# EAGLE schematic untitled (EAGLE 7.5.0)
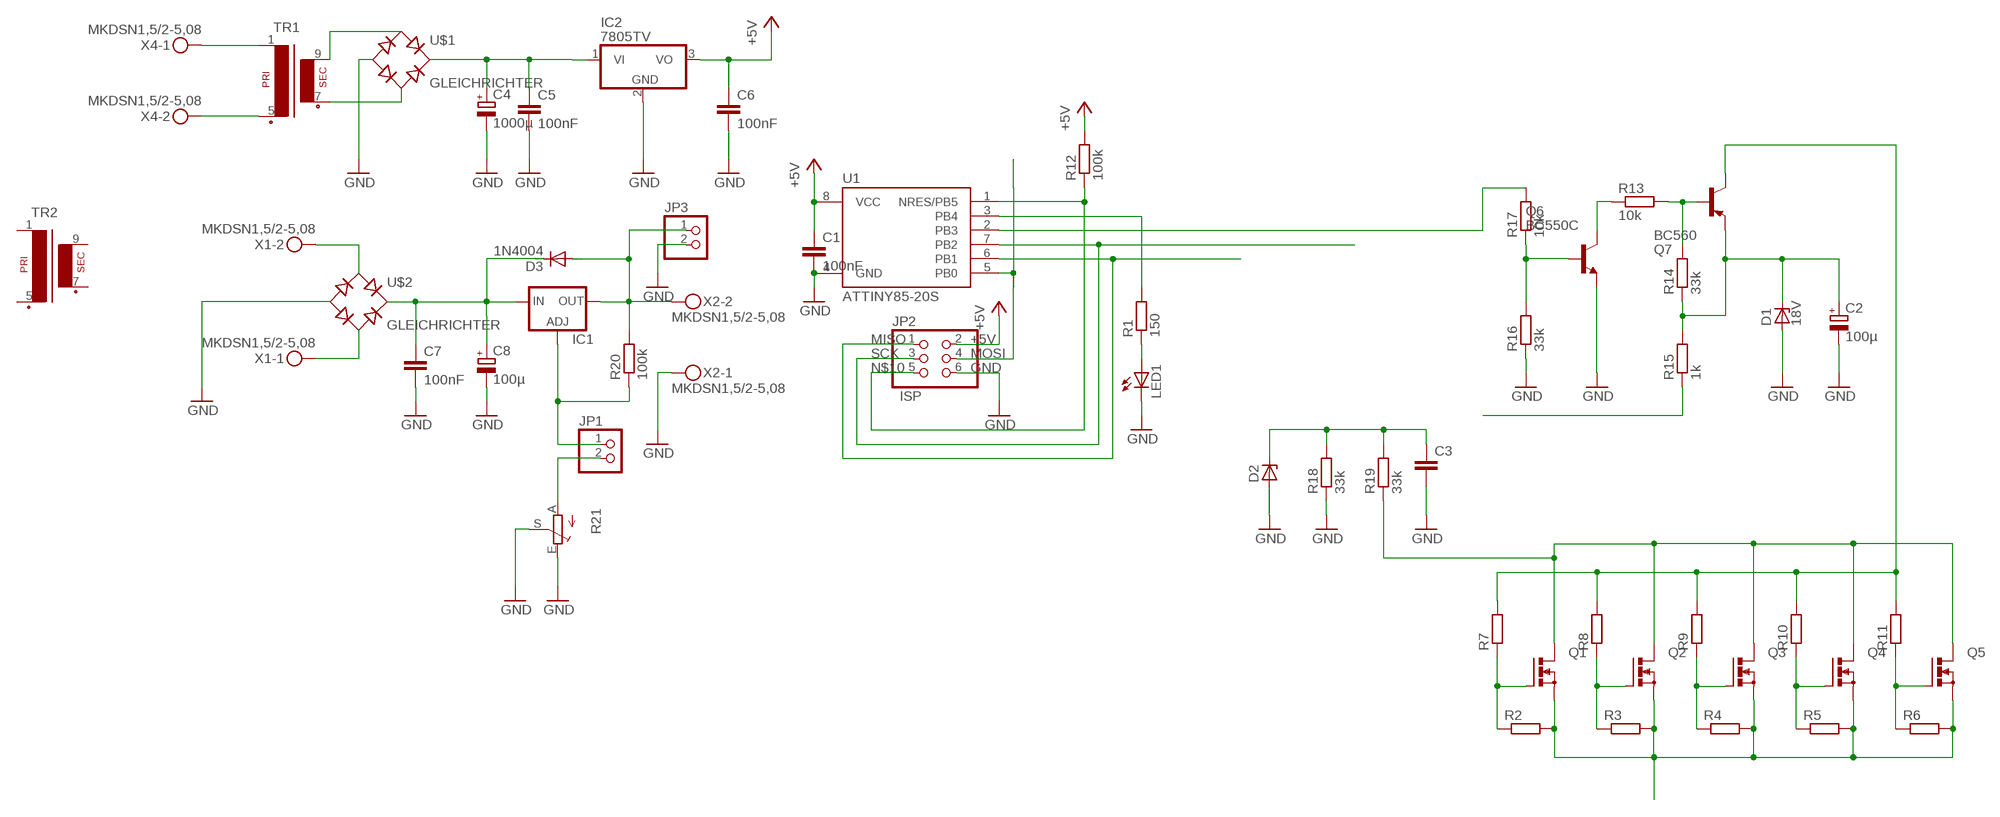
[diagram p0: schematic, sheet 1]

## Parts
C1  100nF  C-EUC0805  [C0805]
C2  100µ  CPOL-EUE2.5-7  [E2,5-7]
C3  C-EUC0603K  [C0603K]
C4  1000µ  CPOL-EUE3.5-8  [E3,5-8]
C5  100nF  C-EUC0805  [C0805]
C6  100nF  C-EUC0805  [C0805]
C7  100nF  C-EUC0805  [C0805]
C8  100µ  CPOL-EUE3.5-8  [E3,5-8]
D1  18V  ZENER-DIODESOD80C  [SOD80C]
D2  ZENER-DIODESOT23  [SOT23]
D3  1N4004  [DO41-10]
IC1  LM317TS  [317TS]
IC2  7805TV  [TO220V]
JP1  PINHD-1X2  [1X02]
JP2  PINHD-2X3  [2X03]
JP3  PINHD-1X2  [1X02]
LED1  LED3MM  [LED3MM]
Q1  PMOSFET_NTO220BV  [TO220BV]
Q2  PMOSFET_NTO220BV  [TO220BV]
Q3  PMOSFET_NTO220BV  [TO220BV]
Q4  PMOSFET_NTO220BV  [TO220BV]
Q5  PMOSFET_NTO220BV  [TO220BV]
Q6  BC550C  [TO92-EBC]
Q7  BC560  [TO92-EBC]
R1  150  R-EU_R1206  [R1206]
R2  R-EU_0207/10  [0207/10]
R3  R-EU_0207/10  [0207/10]
R4  R-EU_0207/10  [0207/10]
R5  R-EU_0207/10  [0207/10]
R6  R-EU_0207/10  [0207/10]
R7  R-EU_0207/10  [0207/10]
R8  R-EU_0207/10  [0207/10]
R9  R-EU_0207/10  [0207/10]
R10  R-EU_0207/10  [0207/10]
R11  R-EU_0207/10  [0207/10]
R12  100k  R-EU_R1206  [R1206]
R13  10k  R-EU_R1206  [R1206]
R14  33k  R-EU_R1206  [R1206]
R15  1k  R-EU_R1206  [R1206]
R16  33k  R-EU_R1206  [R1206]
R17  10k  R-EU_R1206  [R1206]
R18  33k  R-EU_R1206  [R1206]
R19  33k  R-EU_R1206  [R1206]
R20  100k  R-EU_R1206  [R1206]
R21  TRIM_EU-PT10  [PT-10]
TR1  EI38-1  [EI38-1]
TR2  EI38-1  [EI38-1]
U1  ATTINY85-20S  [SOIC8_EIAJ_208MIL]
U$1  GLEICHRICHTER  [KBPC1]
U$2  GLEICHRICHTER  [KBPC1]
X1  MKDSN1,5/2-5,08  [MKDSN1,5/2-5,08]
X2  MKDSN1,5/2-5,08  [MKDSN1,5/2-5,08]
X4  MKDSN1,5/2-5,08  [MKDSN1,5/2-5,08]

## Nets
+5V: C1.1 C6.1 IC2.3(VO) JP2.2 R12.2 U1.8(VCC)
GND: C1.2 C2.- C3.2 C4.- C5.2 C6.2 C7.2 C8.- D1.A D2.1(A) IC2.2(GND) JP2.6 JP3.2 LED1.K(C) Q6.E R16.1 R18.1 R21.E R21.S U1.4(GND) U$1.- U$2.- X2.1
MISO: JP2.1 U1.6(PB1)
MOSI: JP2.4 U1.5(PB0)
N$1: Q7.B R13.2 R14.2
N$2: Q5.G R6.1 R11.1
N$3: Q6.B R16.2 R17.1
N$4: Q4.G R5.1 R10.1
N$5: Q6.C R13.1
N$6: LED1.A R1.1
N$7: Q3.G R4.1 R9.1
N$8: C2.+ D1.C Q7.E R14.1 R15.2
N$9: Q2.G R3.1 R8.1
N$10: JP2.5 R12.1 U1.1(NRES/PB5)
N$11: Q1.S Q2.S Q3.S Q4.S Q5.S R2.2 R3.2 R4.2 R5.2 R6.2
N$12: R1.2 U1.3(PB4)
N$13: Q1.G R2.1 R7.1
N$14: C3.1 D2.3(C) R18.2 R19.2
N$15: R15.1
N$16: Q1.D Q2.D Q3.D Q4.D Q5.D R19.1
N$17: C4.+ C5.1 IC2.1(VI) U$1.+
N$18: Q7.C R7.2 R8.2 R9.2 R10.2 R11.2
N$19: TR1.1 X4.1
N$20: TR1.5(P2) X4.2
N$21: TR1.7(S3) U$1.AC2
N$22: TR1.9(S4) U$1.AC1
N$23: R17.2 U1.2(PB3)
N$24: U$2.AC1 X1.2
N$25: U$2.AC2 X1.1
N$27: C7.1 C8.+ D3.C IC1.3(IN) U$2.+
N$28: D3.A IC1.2(OUT) JP3.1 R20.2 X2.2
N$29: JP1.2 R21.A
N$30: IC1.1(ADJ) JP1.1 R20.1
SCK: JP2.3 U1.7(PB2)
Unconnected: TR2.1 TR2.5(P2) TR2.7(S3) TR2.9(S4)

## Notes on the sheet
- ISP

## Library data of the parts
C1 C3 C5-C7 = rcl:C-EU: CAPACITOR, European symbol
C2 = resistor:CPOL-EU: POLARIZED CAPACITOR, European symbol
C4 C8 = rcl:CPOL-EU: POLARIZED CAPACITOR, European symbol
D1 D2 = diode:ZENER-DIODE: Z-Diode
D3 = diode:1N4004: DIODE general purpose rectifier, 1 A
IC1 = v-reg:LM317TS: VOLTAGE REGULATOR
IC2 = linear:78*: Positive VOLTAGE REGULATOR Source: http://cache.national.com/ds/LM/LM78L05.pdf http://www.fairchildsemi.com/ds/LM/LM7805.pdf
JP1 JP3 = pinhead:PINHD-1X2: PIN HEADER
JP2 = pinhead:PINHD-2X3: PIN HEADER
LED1 = led:LED: LED OSRAM: - CHIPLED LG R971, LG N971, LY N971, LG Q971, LY Q971, LO R971, LY R971 LH N974, LH R974 LS Q976, LO Q976, LY Q976 LO Q996 - Hyper CHIPLED LW Q18S LB Q993, LB Q99A, LB R99A - SideLED LS A670, LO A670, LY A670, LG A670, LP A670 LB A673, LV A673, LT A673, LW A673 LH A674 LY A675 LS A676, LA A676, LO A676, LY A676, LW A676 LS A679, LY A679, LG A679 - Hyper Micro SIDELED® LS Y876, LA Y876, LO Y876, LY Y876 LT Y87S - SmartLED LW L88C, LW L88S LB L89C, LB L89S, LG L890 LS L89K, LO L89K, LY L89K LS L896, LA L896, LO L896, LY L896 - TOPLED LS T670, LO T670, LY T670, LG T670, LP T670 LSG T670, LSP T670, LSY T670, LOP T670, LYG T670 LG T671, LOG T671, LSG T671 LB T673, LV T673, LT T673, LW T673 LH T674 LS T676, LA T676, LO T676, LY T676, LB T676, LH T676, LSB T676, LW T676 LB T67C, LV T67C, LT T67C, LS T67K, LO T67K, LY T67K, LW E67C LS E67B, LA E67B, LO E67B, LY E67B, LB E67C, LV E67C, LT E67C LW T67C LS T679, LY T679, LG T679 LS T770, LO T770, LY T770, LG T770, LP T770 LB T773, LV T773, LT T773, LW T773 LH T774 LS E675, LA E675, LY E675, LS T675 LS T776, LA T776, LO T776, LY T776, LB T776 LHGB T686 LT T68C, LB T68C - Hyper Mini TOPLED® LB M676 - Mini TOPLED Santana® LG M470 LS M47K, LO M47K, LY M47K Source: http://www.osram.convergy.de LUXEON: - LUMILED® LXK2-PW12-R00, LXK2-PW12-S00, LXK2-PW14-U00, LXK2-PW14-V00 LXK2-PM12-R00, LXK2-PM12-S00, LXK2-PM14-U00 LXK2-PE12-Q00, LXK2-PE12-R00, LXK2-PE12-S00, LXK2-PE14-T00, LXK2-PE14-U00 LXK2-PB12-K00, LXK2-PB12-L00, LXK2-PB12-M00, LXK2-PB14-N00, LXK2-PB14-P00, LXK2-PB14-Q00 LXK2-PR12-L00, LXK2-PR12-M00, LXK2-PR14-Q00, LXK2-PR14-R00 LXK2-PD12-Q00, LXK2-PD12-R00, LXK2-PD12-S00 LXK2-PH12-R00, LXK2-PH12-S00 LXK2-PL12-P00, LXK2-PL12-Q00, LXK2-PL12-R00 Source: www.luxeon.com KINGBRIGHT: KA-3528ASYC Source: www.kingbright.com
Q1-Q5 = transistor-power:PMOSFET_N: Power MOSFET N-Channel
Q6 = transistor-npn:BC550*: NPN Transistor
Q7 = transistor-pnp:BC560*: PNP Transistror
R1 R12 R20 = rcl:R-EU_: RESISTOR, European symbol
R2-R11 R13-R19 = resistor:R-EU_: RESISTOR, European symbol
R21 = pot:TRIM_EU-: POTENTIOMETER
TR1 TR2 = trafo:EI38-1: TRANSFORMER 1 primary winding, 1 secondary winding ERA
U1 = _hhn_attiny25_45_85:ATTINY85*: ATMEL ATtiny 85 Packages: P = PDIP 08 30mil S = SOIC 08 EIAJ 208mil Technologies Note: for complete ordering code (temp. range, finish, tape&reel etc.) see www.atmel.com • Supply Voltage: V = (1.8…5.5)V | [blank] = (2.7…5.5)V • Speed: 10 = 10 MHz | 20 = 20 MHz Author: Dipl.-Ing. FH Rainer Bayer HHN Hochschule Heilbronn (Heilbronn University), rainer.bayer@hs-heilbronn.de Ingenieurbüro ing-rb, mail@ing-rb.de
U$1 U$2 = Gleichrichter:GLEICHRICHTER
X1 X2 X4 = con-phoenix-508:MKDSN1,5/2-5,08: MKDSN 1,5/ 2-5,08 Printklemme Nennstrom: 13,5 A Nennspannung: 250 V Rastermaß: 5,08 mm Polzahl: 2 Anschlussart: Schraubanschluss Montage: Löten Anschlussrichtung Leiter/Platine: 0 ° Artikelnummer: 1729128 Source: http://eshop.phoenixcontact.com .. 1729128.pdf